# EAGLE design H08R6 (EAGLE 9.6.1)

## Sheet 1 of 2
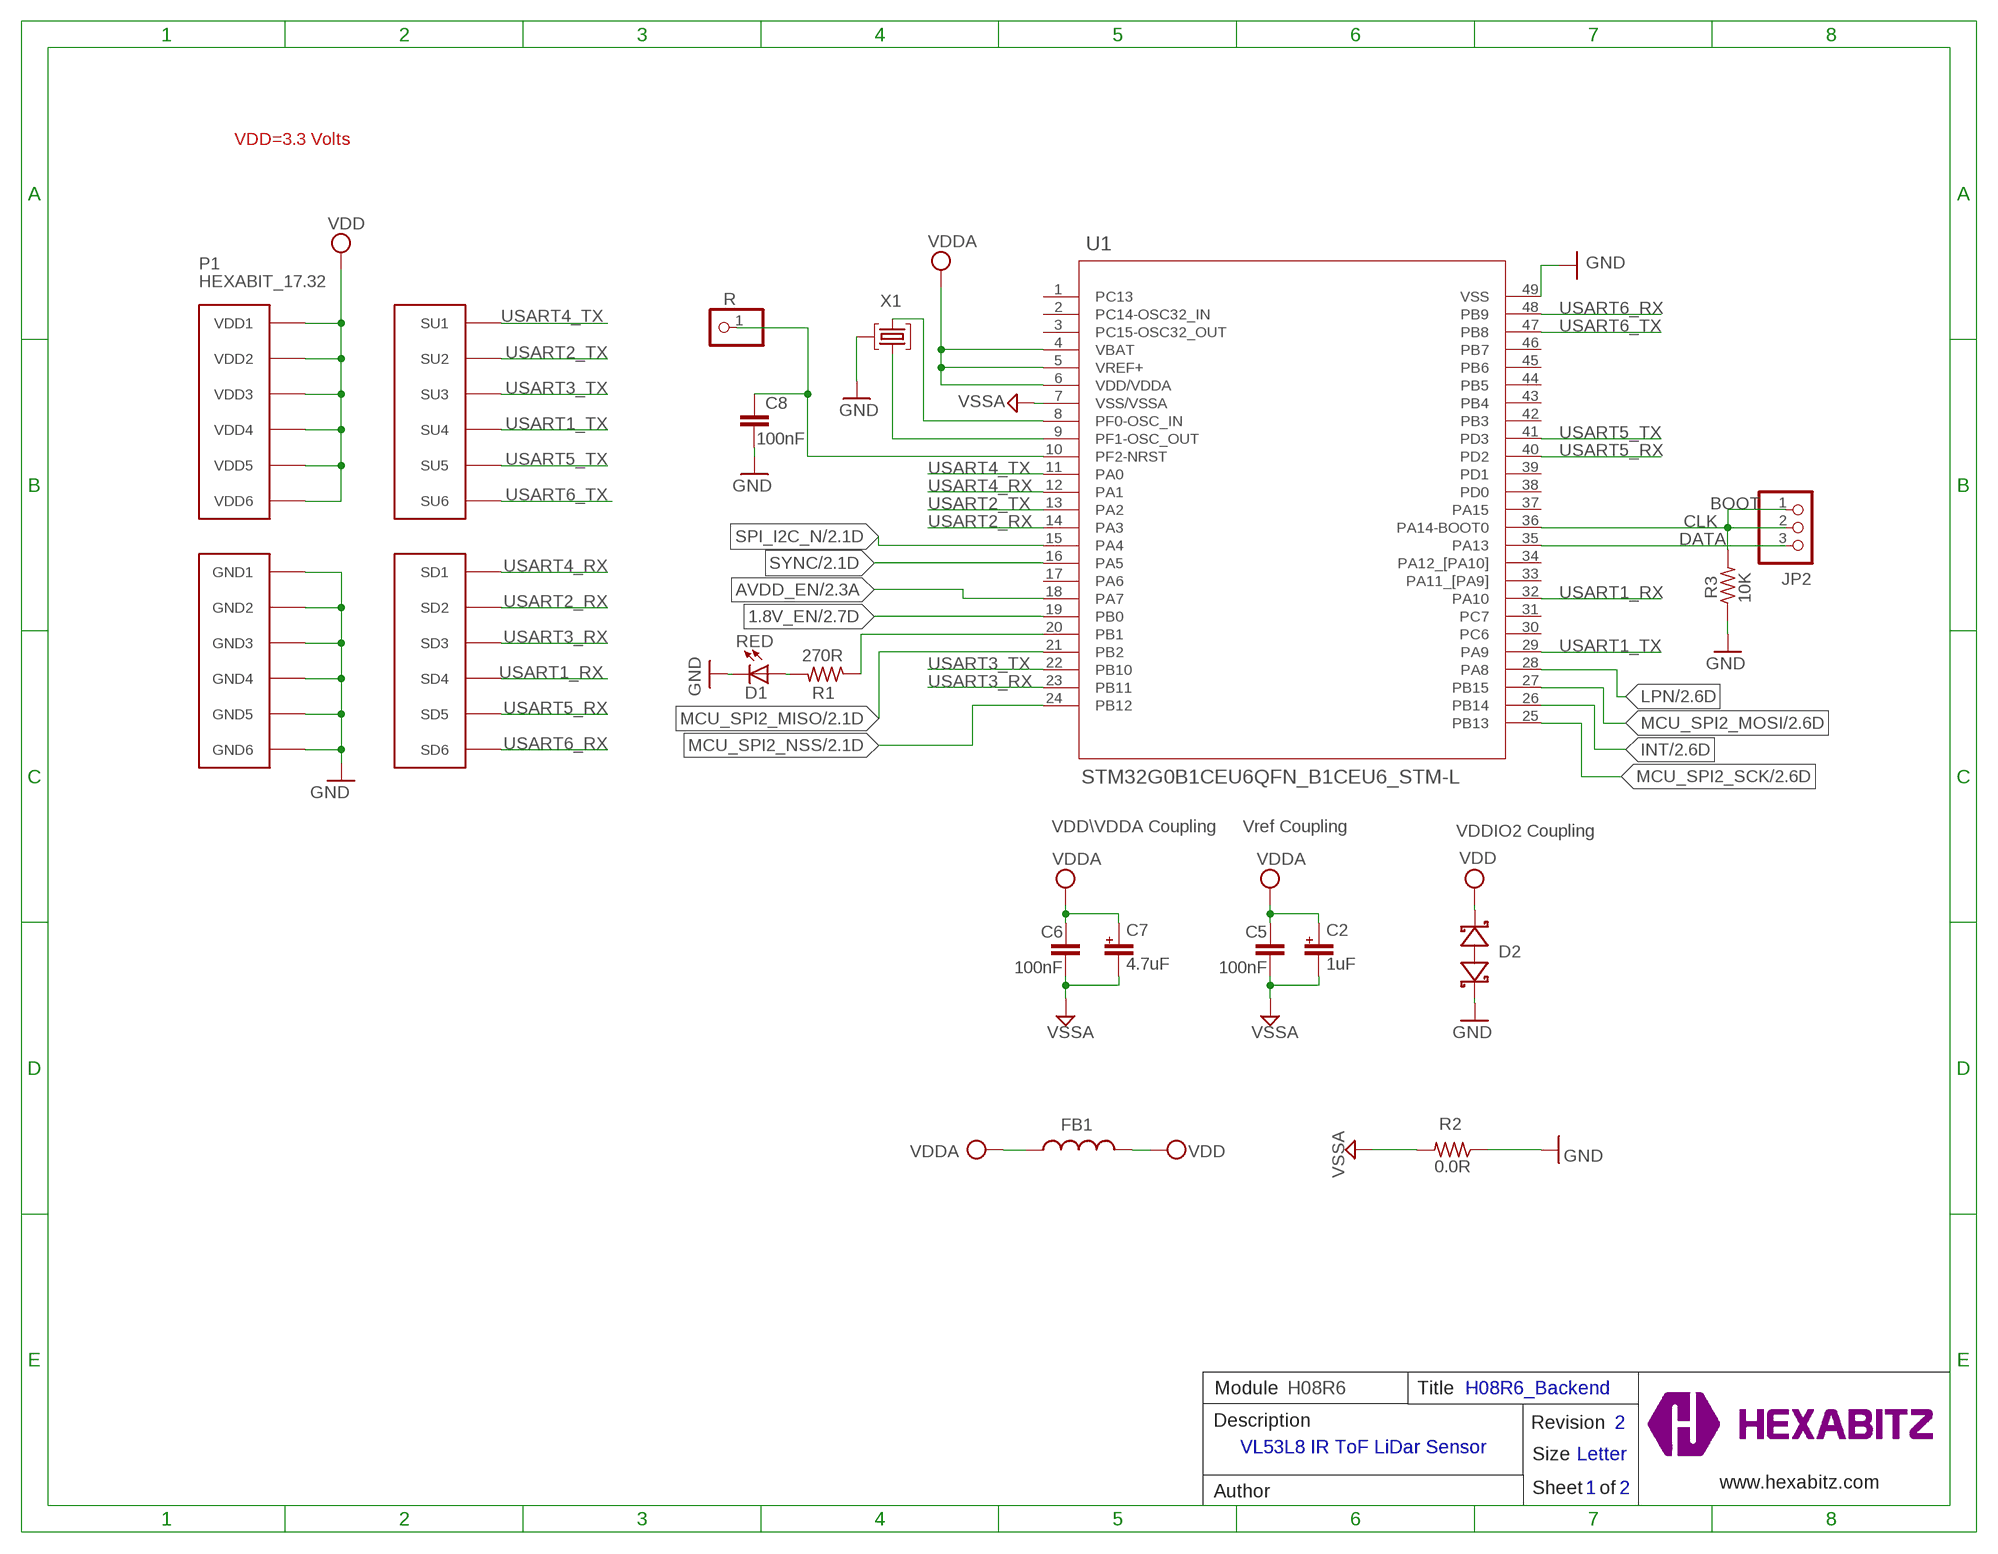
[diagram p0: schematic, sheet 1]

### Parts
C2  1uF  C-0603-POL  [C-0603-POL]
C5  100nF  C-0402  [C-0402]
C6  100nF  C-0402  [C-0402]
C7  4.7uF  C-0603-POL  [C-0603-POL]
C8  100nF  C-0402  [C-0402]
D1  RED  VLMS1300-GS08  [VLMS1300-GS08]
D2  BOURNS_CDSOD323-T03SCBOURNS_CDSOD323-T03SC_0_0  [BOURNS_CDSOD323-T03SC_0]
FB1  FB-TDK_MMZ1608Y300B  [FB-TDK_MMZ1608Y300B]
JP2  PINHD-1X3  [1X03]
P1  HEXABIT_17.32  [HEXABIT_17.32]
R  R  PINHD-1X1  [1X01]
R1  270R  R-0402  [R-0402]
R2  0.0R  R-0402  [R-0402]
R3  10K  R-0402  [R-0402]
TRIMBLE-LOGO1  HEXA-LOGO  [HEXA-LOGO]
U1  STM32G0B1CEU6QFN_B1CEU6_STM-L  [QFN_B1CEU6_STM-L]
X1  XTALL_CSTCE8M00G52  [XTALL_CSTCE8M00G52]

### Nets
1.8V_EN: U1.19(PB0) ; also sheet 2
AVDD_EN: U1.18(PA7) ; also sheet 2
CLK: JP2.1 JP2.2 R3.2 U1.36(PA14-BOOT0)
DATA: JP2.3 U1.35(PA13)
GND: C8.2 D1.C D2.2(C) P1.PAD_PD7(GND1) P1.PAD_PD8(GND2) P1.PAD_PD9(GND3) P1.PAD_PD10(GND4) P1.PAD_PD11(GND5) P1.PAD_PD12(GND6) R2.1 R3.1 U1.49(VSS) X1.P$2 ; also sheet 2
INT: U1.26(PB14) ; also sheet 2
LPN: U1.28(PA8) ; also sheet 2
MCU_SPI2_MISO: U1.21(PB2) ; also sheet 2
MCU_SPI2_MOSI: U1.27(PB15) ; also sheet 2
MCU_SPI2_NSS: U1.24(PB12) ; also sheet 2
MCU_SPI2_SCK: U1.25(PB13) ; also sheet 2
N$3: D1.A R1.2
N$4: C8.1 R.1 U1.10(PF2-NRST)
N$5: U1.9(PF1-OSC_OUT) X1.P$1
N$6: U1.8(PF0-OSC_IN) X1.P$3
N$7: R1.1 U1.20(PB1)
SPI_I2C_N: U1.15(PA4) ; also sheet 2
SYNC: U1.16(PA5) ; also sheet 2
USART1_RX: P1.PAD_PD4(SD4) U1.32(PA10)
USART1_TX: P1.PAD_PU4(SU4) U1.29(PA9)
USART2_RX: P1.PAD_PD2(SD2) U1.14(PA3)
USART2_TX: P1.PAD_PU2(SU2) U1.13(PA2)
USART3_RX: P1.PAD_PD3(SD3) U1.23(PB11)
USART3_TX: P1.PAD_PU3(SU3) U1.22(PB10)
USART4_RX: P1.PAD_PD1(SD1) U1.12(PA1)
USART4_TX: P1.PAD_PU1(SU1) U1.11(PA0)
USART5_RX: P1.PAD_PD5(SD5) U1.40(PD2)
USART5_TX: P1.PAD_PU5(SU5) U1.41(PD3)
USART6_RX: P1.PAD_PD6(SD6) U1.48(PB9)
USART6_TX: P1.PAD_PU6(SU6) U1.47(PB8)
VDD: D2.1(A) FB1.2 P1.PAD_PU7(VDD1) P1.PAD_PU8(VDD2) P1.PAD_PU9(VDD3) P1.PAD_PU10(VDD4) P1.PAD_PU11(VDD5) P1.PAD_PU12(VDD6) ; also sheet 2
VDDA: C2.1 C5.1 C6.1 C7.1 FB1.1 U1.4(VBAT) U1.5(VREF+) U1.6(VDD/VDDA)
VSSA: C2.2 C5.2 C6.2 C7.2 R2.2 U1.7(VSS/VSSA)
Unconnected: U1.1(PC13) U1.2(PC14-OSC32_IN) U1.3(PC15-OSC32_OUT) U1.17(PA6) U1.30(PC6) U1.31(PC7) U1.33(PA11_[PA9]) U1.34(PA12_[PA10]) U1.37(PA15) U1.38(PD0) U1.39(PD1) U1.42(PB3) U1.43(PB4) U1.44(PB5) U1.45(PB6) U1.46(PB7)

### Notes on the sheet
- VDD=3.3 Volts
- BOOT
- VDD\VDDA Coupling | Vref Coupling | VDDIO2 Coupling
- Module | H08R6 | Title | H08R6_Backend
- Description | Revision | 2
- VL53L8 IR ToF LiDar Sensor
- Size | Letter
- www.hexabitz.com
- Author | Sheet   of | 1 | 2
- C:/Users/Admin/Desktop/logodraft.bmp

## Sheet 2 of 2
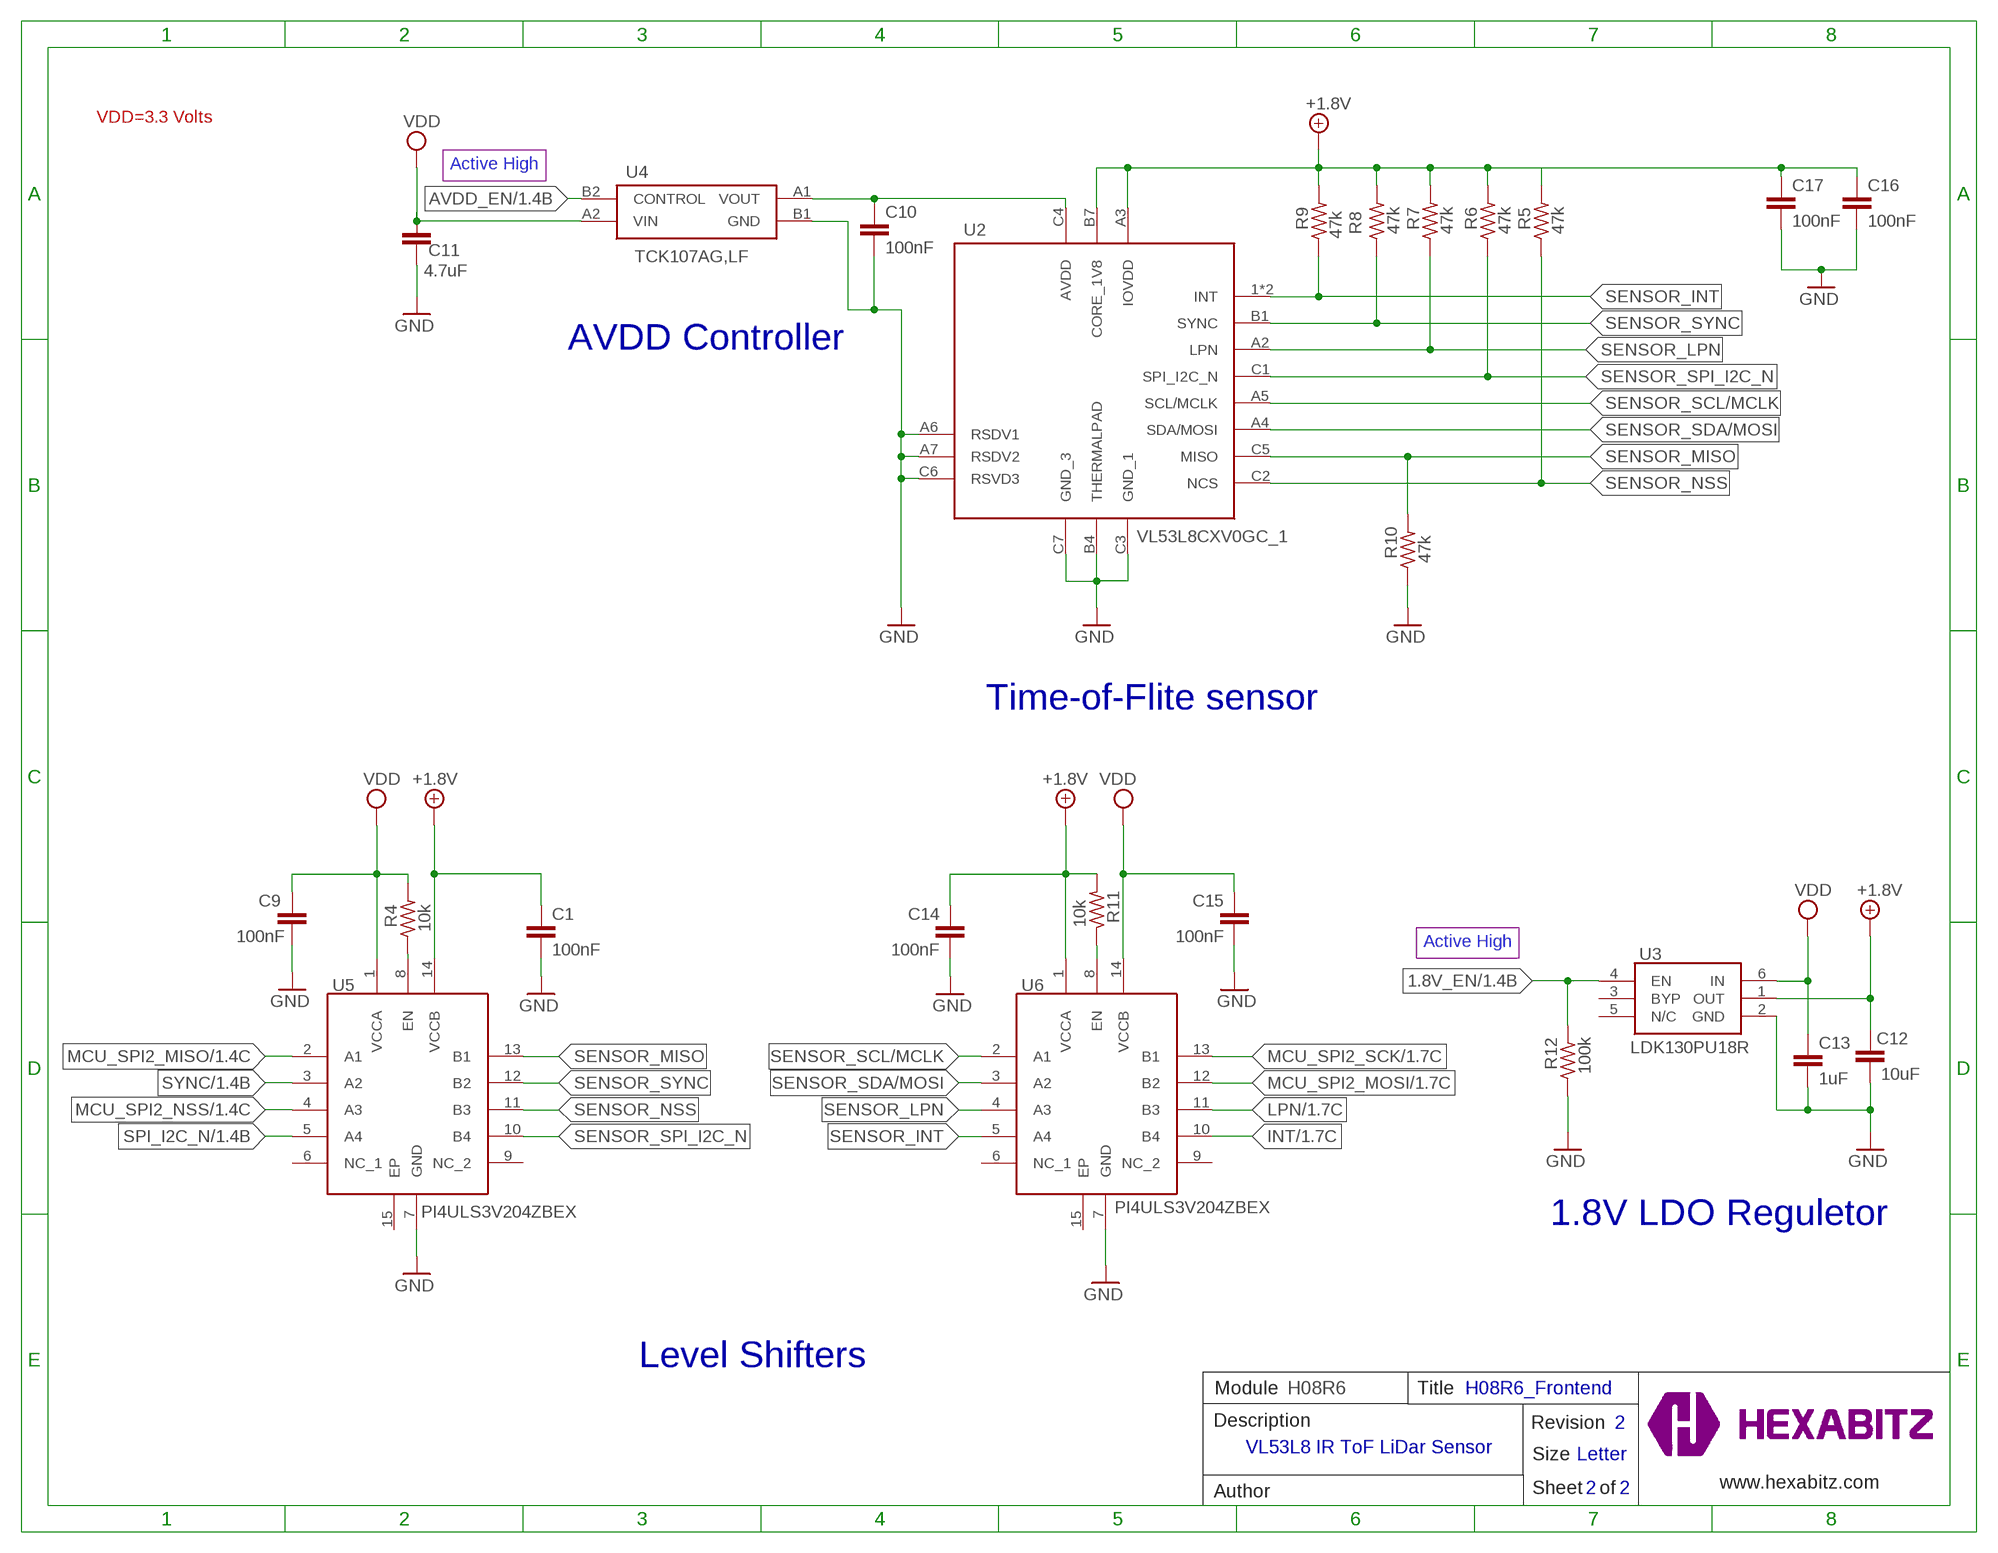
[diagram p1: schematic, sheet 2]

### Parts
C1  100nF  C-0402  [C-0402]
C9  100nF  C-0402  [C-0402]
C10  100nF  C-0402  [C-0402]
C11  4.7uF  C-0603  [C-0603]
C12  10uF  C-0402  [C-0402]
C13  1uF  C-0402  [C-0402]
C14  100nF  C-0402  [C-0402]
C15  100nF  C-0402  [C-0402]
C16  100nF  C-0402  [C-0402]
C17  100nF  C-0402  [C-0402]
R4  10k  R-0402  [R-0402]
R5  47k  R-0402  [R-0402]
R6  47k  R-0402  [R-0402]
R7  47k  R-0402  [R-0402]
R8  47k  R-0402  [R-0402]
R9  47k  R-0402  [R-0402]
R10  47k  R-0402  [R-0402]
R11  10k  R-0402  [R-0402]
R12  100k  R-0402  [R-0402]
U2  VL53L8CXV0GC_1  [VL53L8CXV0GC1]
U3  LDK130PU18R  [LDK130PU18R]
U4  TCK107AG,LF  [BGA4C40P2X2_79X79X59]
U5  PI4ULS3V204ZBEX  [PI4ULS3V204ZBEX]
U6  PI4ULS3V204ZBEX  [PI4ULS3V204ZBEX]

### Nets
1.8V_EN: R12.2 U3.4(EN) ; also sheet 1
+1.8V: C1.1 C12.1 C14.1 C16.1 C17.1 R5.2 R6.2 R7.2 R8.2 R9.2 R11.2 U2.A3(IOVDD) U2.B7(CORE_1V8) U3.1(OUT) U5.14(VCCB) U6.1(VCCA)
AVDD_EN: U4.B2(CONTROL) ; also sheet 1
CONTROLLED_AVDD: C10.1 U2.C4(AVDD) U4.A1(VOUT)
GND: C1.2 C9.2 C10.2 C11.2 C12.2 C13.2 C14.2 C15.2 C16.2 C17.2 R10.1 R12.1 U2.A6(RSDV1) U2.A7(RSDV2) U2.B4(THERMALPAD) U2.C3(GND_1) U2.C6(RSVD3) U2.C7(GND_3) U3.2(GND) U4.B1(GND) U5.7(GND) U6.7(GND) ; also sheet 1
INT: U6.10(B4) ; also sheet 1
LPN: U6.11(B3) ; also sheet 1
MCU_SPI2_MISO: U5.2(A1) ; also sheet 1
MCU_SPI2_MOSI: U6.12(B2) ; also sheet 1
MCU_SPI2_NSS: U5.4(A3) ; also sheet 1
MCU_SPI2_SCK: U6.13(B1) ; also sheet 1
N$1: R4.1 U5.8(EN)
N$2: R11.1 U6.8(EN)
SENSOR_INT: R9.1 U2.1(INT) U2.A1(INT) U6.5(A4)
SENSOR_LPN: R7.1 U2.A2(LPN) U6.4(A3)
SENSOR_MISO: R10.2 U2.C5(MISO) U5.13(B1)
SENSOR_NSS: R5.1 U2.C2(NCS) U5.11(B3)
SENSOR_SCL/MCLK: U2.A5(SCL/MCLK) U6.2(A1)
SENSOR_SDA/MOSI: U2.A4(SDA/MOSI) U6.3(A2)
SENSOR_SPI_I2C_N: R6.1 U2.C1(SPI_I2C_N) U5.10(B4)
SENSOR_SYNC: R8.1 U2.B1(SYNC) U5.12(B2)
SPI_I2C_N: U5.5(A4) ; also sheet 1
SYNC: U5.3(A2) ; also sheet 1
VDD: C9.1 C11.1 C13.1 C15.1 R4.2 U3.6(IN) U4.A2(VIN) U5.1(VCCA) U6.14(VCCB) ; also sheet 1
Unconnected: U3.3(BYP) U3.5(N/C) U5.6(NC_1) U5.9(NC_2) U5.15(EP) U6.6(NC_1) U6.9(NC_2) U6.15(EP)

### Notes on the sheet
- VDD=3.3 Volts
- Active High
- AVDD Controller
- Time-of-Flite sensor
- Active High
- 1.8V LDO Reguletor
- Level Shifters
- Module | H08R6 | Title | H08R6_Frontend
- Description | Revision | 2
- VL53L8 IR ToF LiDar Sensor
- Size | Letter
- www.hexabitz.com
- Author | Sheet   of | 2 | 2

## Library data of the parts
C1 C5 C6 C8-C10 C12-C17 = HEXABITZ_RCLS:C-0402: CAP CER 10% 0402
C2 C7 = HEXABITZ_RCLS:C-0603-POL
C11 = HEXABITZ_RCLS:C-0603: CAP CER 10% X7R 0603
D1 = HEXABITZ_USER_INTERFACE_PARTS:VLMS1300-GS08: Red 0603 130° Clear 54 mcd 2 V Surface Mount ChipLED ; Octopart Url : http://octopart.com/vlms1300-gs08-vishay-21709201; MFN: Vishay; MPN: VLMS1300-GS08; OCTOPART_URL: https://octopart.com/vlms1300-gs08-vishay-21709201?r=sp&s=_gcP4_q8T1SC6PJQPTQ9yA
D2 = HEXABITZ_RCLS:BOURNS_CDSOD323-T03SC: CDSOD323-TxxSC - TVS Diode Series; DESCRIPTION: Dio Tvs Vwm 03V 500W Bidir Sod323 / Tape & Reel - 7" Reel; MFN: Bourns; MPN: CDSOD323-T03SC; OCTOPART_URL: https://octopart.com/cdsod323-t03sc-bourns-10487153?r=sp
FB1 = HEXABITZ_RCLS:FB-TDK_MMZ1608Y300B: Ferrite Beads Multi-Layer 30Ohm 25% 100MHz 1.5A 50mOhm DCR 0603; MFN: TDK; MPN: MMZ1608Y300B; OCTOPART_URL: https://octopart.com/mmz1608y300b-tdk-368280?r=sp&s=cd9_2ZEqQ9q9UNBuQgHAiA
JP2 = pinhead:PINHD-1X3: PIN HEADER
P1 = hexabitz_connectors:HEXABIT_?: Hexabitz Hexagon Module Connector Hexagon side length = 28.87mm.
R = HEXABITZ_USER_INTERFACE_PARTS:PINHD-1X1: PIN HEADER; MFN: TE Connectivity; MPN: 87227-1; OCTOPART_URL: https://octopart.com/87227-1-te+connectivity-39512052?r=sp
R1 R3-R12 = HEXABITZ_RCLS:R-0402: Thick Film Resistors - SMD 0603
R2 = HEXABITZ_RCLS:R-0402: Thick Film Resistors - SMD 0603; MFN: Yageo; MPN: RC0603JR-070RL; OCTOPART_URL: https://octopart.com/rc0603jr-070rl-yageo-1241539?r=sp&s=X2NteqRjRNWrnx42Y0aliA; RESISTANCE: 0.0 Ohm
TRIMBLE-LOGO1 = HEXABITZ_USER_INTERFACE_PARTS:HEXA-LOGO: Trimble-Logo
U1 = HEXABITZ_ICs:STM32G0B1CEU6; COPYRIGHT: Copyright (C) 2021 Ultra Librarian. All rights reserved.; MANUFACTURER_PART_NUMBER: STM32G0B1CEU6; MFR_NAME: STMicroelectronics
U2 = HEXABITZ_ICs:VL53L8CXV0GC_1: Low-power high-performance 8x8 multizone Time-of-Flight sensor 940 nm, 6.4x3.0x1.75 mm, -30 to 85C Source: Datasheet <https://www.st.com/resource/en/datasheet/vl53l8cx.pdf>; ARROW_PART_NUMBER: VL53L8CXV0GC/1; ARROW_PRICE-STOCK: https://www.arrow.com/en/products/vl53l8cxv0gc1/stmicroelectronics?region=europe; DESCRIPTION: Low-power high-performance 8x8 multizone Time-of-Flight sensor 940 nm, 6.4x3.0x1.75 mm, -30 to 85C; HEIGHT: 1.8mm; MANUFACTURER_NAME: STMicroelectronics; MANUFACTURER_PART_NUMBER: VL53L8CXV0GC/1; MOUSER_PART_NUMBER: 511-VL53L8CXV0GC/1; MOUSER_PRICE-STOCK: https://www.mouser.co.uk/ProductDetail/STMicroelectronics/VL53L8CXV0GC-1?qs=T%252BzbugeAwjhc9idkQC%252BF8g%3D%3D
U3 = HEXABITZ_ICs:LDK130PU18R: LDO Voltage Regulators 300mA current very low noise LDO Source: Datasheet <http://www.st.com/web/en/resource/technical/document/datasheet/DM00076097.pdf>; DESCRIPTION: LDO Voltage Regulators 300mA current very low noise LDO; HEIGHT: 0.5mm; MANUFACTURER_NAME: STMicroelectronics; MANUFACTURER_PART_NUMBER: LDK130PU18R; MOUSER_PART_NUMBER: 511-LDK130PU18R; MOUSER_PRICE-STOCK: https://www.mouser.co.uk/ProductDetail/STMicroelectronics/LDK130PU18R?qs=Us3gTOFd0HosQ%2FeNbz5XPw%3D%3D
U4 = HEXABITZ_ICs:TCK107AG,LF: Power Switch ICs - Power Distribution Load Switch IC Source: Datasheet <https://toshiba.semicon-storage.com/info/docget.jsp?did=30131&prodName=TCK106AG>; DESCRIPTION: Power Switch ICs - Power Distribution Load Switch IC; HEIGHT: 0.59mm; MANUFACTURER_NAME: Toshiba; MANUFACTURER_PART_NUMBER: TCK107AG,LF; MOUSER_PART_NUMBER: 757-TCK107AGLF; MOUSER_PRICE-STOCK: https://www.mouser.co.uk/ProductDetail/Toshiba/TCK107AGLF?qs=lX6dEUlT%252Bgfv0djoZbXdYw%3D%3D
U5 U6 = HEXABITZ_ICs:PI4ULS3V204ZBEX: Voltage Level Translator Bidirectional 4 Circuit 1 Channel 2Mbps, 24Mbps 14-TQFN (3.5x3.5) Source: Datasheet <https://www.diodes.com/assets/Datasheets/PI4ULS3V204.pdf>; DESCRIPTION: Voltage Level Translator Bidirectional 4 Circuit 1 Channel 2Mbps, 24Mbps 14-TQFN (3.5x3.5); HEIGHT: 0.9mm; MANUFACTURER_NAME: Diodes Incorporated; MANUFACTURER_PART_NUMBER: PI4ULS3V204ZBEX; MOUSER_PART_NUMBER: 729-PI4ULS3V204ZBEX; MOUSER_PRICE-STOCK: https://www.mouser.co.uk/ProductDetail/Diodes-Incorporated/PI4ULS3V204ZBEX?qs=AQlKX63v8RsT3Gro83mlXA%3D%3D
X1 = HEXABITZ_RCLS:XTALL_CSTCE8M00G52: MURATA CSTCE8M00G52-R0 RESONATOR, SMD, 8MHZ ; Octopart Url : https://octopart.com/cstce8m00g52-r0-murata-7145559; MFN: Murata; MPN: CSTCE8M00G52Z-R0; OCTOPART_URL: https://octopart.com/cstce8m00g52z-r0-murata-17755941?r=sp&s=JDnNJnrHQhyS8Zk4ofFWXw

## Board
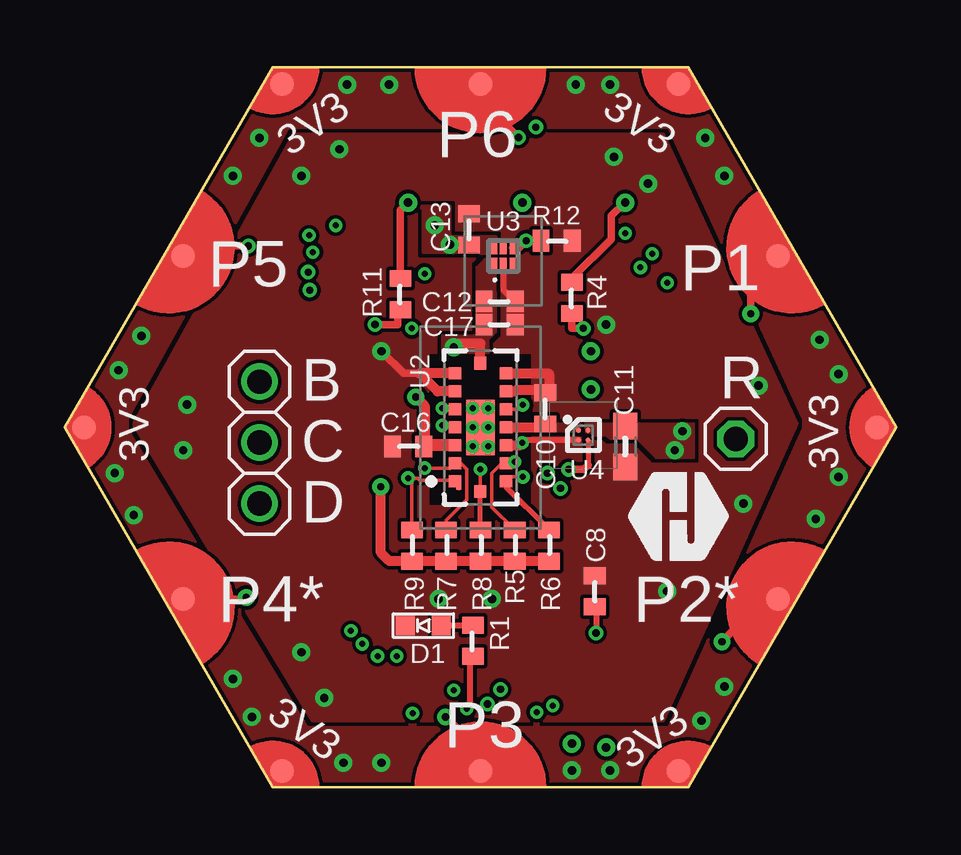
[diagram p2: board, top side]
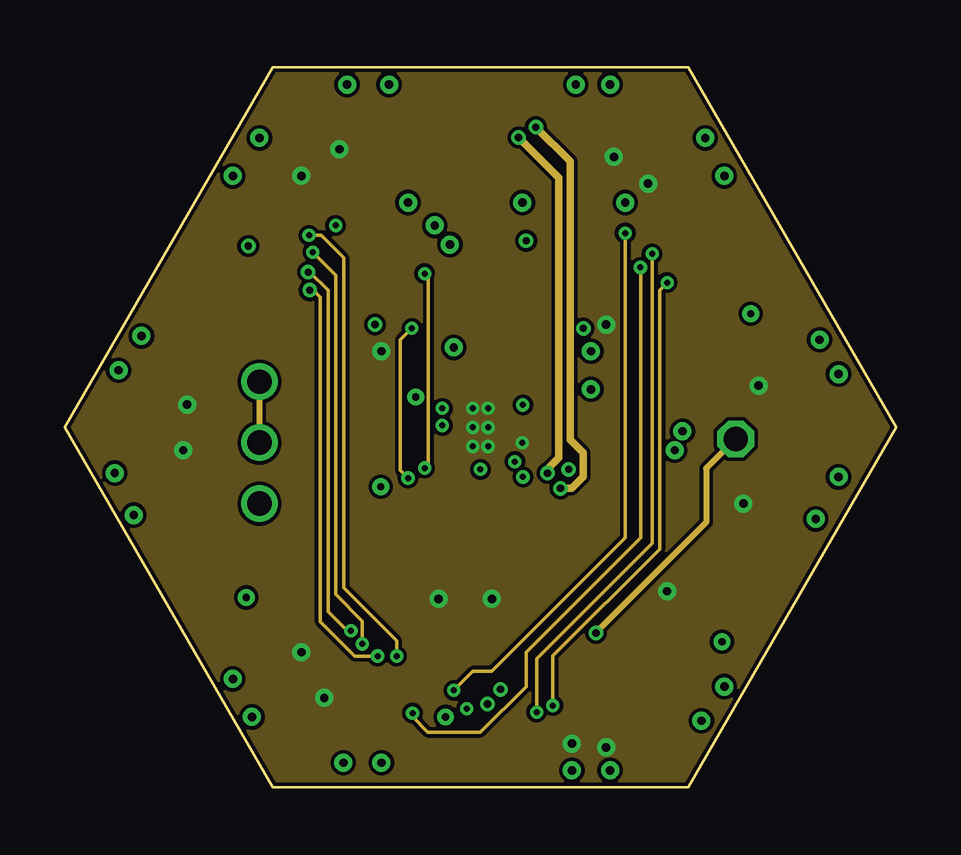
[diagram p3: board, inner layer Route2]
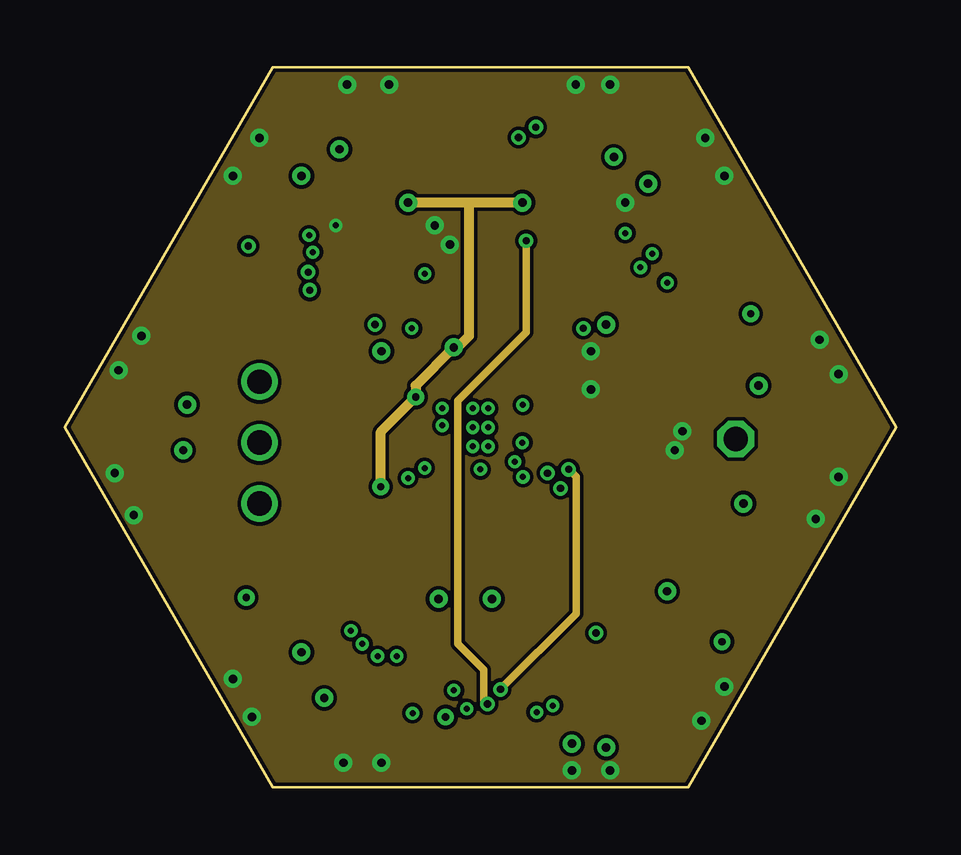
[diagram p4: board, inner layer Route15]
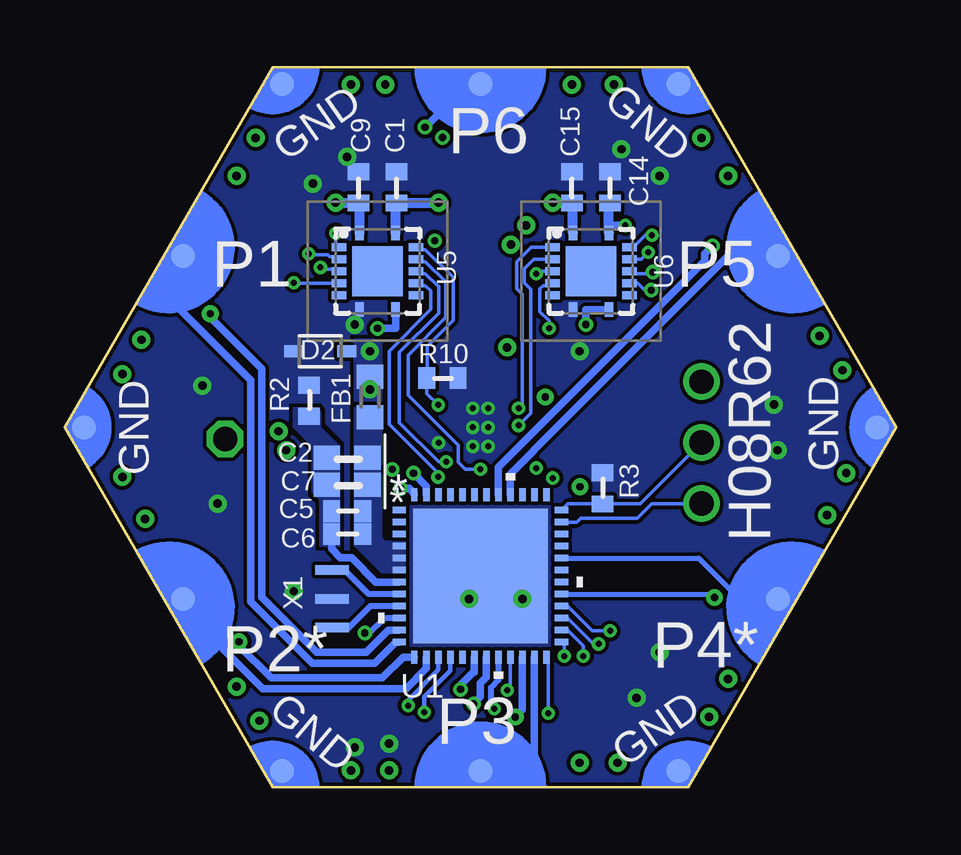
[diagram p5: board, bottom side, seen from below]

Size 34.64 x 30 mm. Coordinates in mm from the lower left corner, seen from the top.
Copper layers (1*2+15*16): Top 0.035mm / dielectric 0.175mm / Route2 0.035mm / dielectric 1.11mm / Route15 0.035mm / dielectric 0.175mm / Bottom 0.035mm
Design rules "4_layer *": minimum track width 6mil, minimum drill 0.2mm, track to track 6mil, track to pad 6mil, pad to pad 6mil, via to via 6mil, smd to smd 0mil, copper to edge 0.15mm, drill to drill 6mil, minimum pad ring 6mil, minimum via ring 3mil, stop-mask expansion 2mil, vias tented up to drill 15mil, thermal gap 10mil

### Footprints (pad centres in the part's own frame; a part is rotated, then mirrored left to right if it is on the bottom)
C-0402 = smd 0.7 x 0.9: 1 -0.65,0; 2 0.65,0
C-0603-POL = smd 1.1 x 1: 1 -0.85,0; 2 0.85,0
C-0603 = smd 1.1 x 1: 1 -0.85,0; 2 0.85,0
VLMS1300-GS08 = smd 0.8 x 0.8: A 0,0.75; C 0,-0.75
BOURNS_CDSOD323-T03SC_0 = smd 0.8 x 0.5: 1 -1.1,0; 2 1.1,0
FB-TDK_MMZ1608Y300B = smd 1 x 1.1: 1 -0.85,0; 2 0.85,0
1X03 = drill 1.016: 1 -2.54,0; 2 0,0; 3 2.54,0
HEXABIT_17.32 = smd 1 x 1 bottom: PAD_PD1 12.39,7.15; PAD_PD2 12.39,-7.15; PAD_PD3 0,-14.31; PAD_PD4 -12.39,-7.15; PAD_PD5 -12.39,7.15; PAD_PD6 0,14.31; PAD_PD7 8.26,14.31; PAD_PD8 16.52,0; PAD_PD9 8.26,-14.31; PAD_PD10 -8.26,-14.31; PAD_PD11 -16.52,0; PAD_PD12 -8.26,14.31 | smd 1 x 1: PAD_PU1 12.39,7.15; PAD_PU2 12.39,-7.15; PAD_PU3 0,-14.31; PAD_PU4 -12.39,-7.15; PAD_PU5 -12.39,7.15; PAD_PU6 0,14.31; PAD_PU7 8.26,14.31; PAD_PU8 16.52,0; PAD_PU9 8.26,-14.31; PAD_PU10 -8.26,-14.31; PAD_PU11 -16.52,0; PAD_PU12 -8.26,14.31
1X01 = drill 1.016 octagon: 1 0,0
R-0402 = smd 0.7 x 0.9: 1 -0.65,0; 2 0.65,0
QFN_B1CEU6_STM-L = smd 0.55 x 0.254: 1 -3.38,2.751; 2 -3.38,2.251; 3 -3.38,1.75; 4 -3.38,1.25; 5 -3.38,0.75; 6 -3.38,0.25; 7 -3.38,-0.25; 8 -3.38,-0.75; 9 -3.38,-1.25; 10 -3.38,-1.75; 11 -3.38,-2.251; 12 -3.38,-2.751; 25 3.38,-2.751; 26 3.38,-2.251; 27 3.38,-1.75; 28 3.38,-1.25; 29 3.38,-0.75; 30 3.38,-0.25; 31 3.38,0.25; 32 3.38,0.75; 33 3.38,1.25; 34 3.38,1.75; 35 3.38,2.251; 36 3.38,2.751 | smd 0.254 x 0.55: 13 -2.751,-3.38; 14 -2.251,-3.38; 15 -1.75,-3.38; 16 -1.25,-3.38; 17 -0.75,-3.38; 18 -0.25,-3.38; 19 0.25,-3.38; 20 0.75,-3.38; 21 1.25,-3.38; 22 1.75,-3.38; 23 2.251,-3.38; 24 2.751,-3.38; 37 2.751,3.38; 38 2.251,3.38; 39 1.75,3.38; 40 1.25,3.38; 41 0.75,3.38; 42 0.25,3.38; 43 -0.25,3.38; 44 -0.75,3.38; 45 -1.25,3.38; 46 -1.75,3.38; 47 -2.251,3.38; 48 -2.751,3.38 | smd 5.6 x 5.6: 49 0,0
VL53L8CXV0GC1 = smd 0.2 x 0.1: 1 -0.9,-2.55 | smd 0.515 x 0.5: A1 -1.058,-2.25; A2 -1.058,-1.5; A3 -1.058,-0.75; A4 -1.058,0; A5 -1.058,0.75; A6 -1.058,1.5; A7 -1.058,2.25; C1 1.058,-2.25; C2 1.058,-1.5; C3 1.058,-0.75; C4 1.058,0; C5 1.058,0.75; C6 1.058,1.5; C7 1.058,2.25 | smd 0.5 x 0.535: B1 0,-2.668; B7 0,2.668 | smd 1.2 x 2.316: B4 0,0
LDK130PU18R = smd 0.28 x 0.53: 1 -0.4,-0.34; 2 0,-0.34; 3 0.4,-0.34; 4 0.4,0.34; 5 0,0.34; 6 -0.4,0.34
BGA4C40P2X2_79X79X59 = smd 0.208 x 0.208: A1 -0.2,0.2; A2 0.2,0.2; B1 -0.2,-0.2; B2 0.2,-0.2
PI4ULS3V204ZBEX = smd 0.6 x 0.35: 1 -1.6,-0.75; 7 1.6,-0.75; 8 1.6,0.75; 14 -1.6,0.75 | smd 0.35 x 0.6: 2 -1,-1.6; 3 -0.5,-1.6; 4 0,-1.6; 5 0.5,-1.6; 6 1,-1.6; 9 1,1.6; 10 0.5,1.6; 11 0,1.6; 12 -0.5,1.6; 13 -1,1.6 | smd 2.1 x 2.1: 15 0,0
XTALL_CSTCE8M00G52 = smd 1.4 x 0.4: P$1 0,1.2; P$2 0,0; P$3 0,-1.2

### Placement (x,y rotation side)
C1  20.81,25 90 bottom
C2  22.88,13.73 180 bottom
C5  22.88,11.51 180 bottom
C6  22.88,10.55 180 bottom
C7  22.88,12.62 180 bottom
C8  22.08,8.17 90 top
C9  22.4,25 90 bottom
C10  20.02,15.79 90 top
C11  23.35,14.21 270 top
C12  18.11,20.24 0 top
C13  16.84,23.25 90 top
C14  13.51,25 90 bottom
C15  11.92,25 90 bottom
C16  14.3,14.21 180 top
C17  18.11,19.29 0 top
D1  14.94,6.74 270 top
D2  23.99,18.18 180 bottom
FB1  21.92,16.27 90 bottom
JP2  8.11,14.36 270 top
P1  17.32,15 0 top
R  27.96,14.52 0 top
R1  17,6.11 90 top
R2  24.46,16.11 270 bottom
R3  12.24,12.46 270 bottom
R4  21.13,20.4 90 top
R5  18.75,10.08 270 top
R6  20.18,10.08 270 top
R7  15.89,10.08 270 top
R8  17.32,10.08 270 top
R9  14.46,10.08 270 top
R10  18.91,17.06 180 bottom
R11  13.99,20.56 90 top
R12  20.5,22.78 180 top
TRIMBLE-LOGO1  25.58,9.44 0 top
U1  17.32,8.81 0 bottom
U2  17.32,15 0 top
U3  18.27,22.14 0 top
U4  21.61,14.68 0 top
U5  21.61,21.51 270 bottom
U6  12.72,21.51 270 bottom
X1  23.51,7.86 180 bottom

### Tracks (layer width: path | path; a pad name or v marks a point on that pad's centre or on a via)
1.8V_EN  (via drill 0.3 pad 0.6)
  Top 0.305: U3.4 18.93,22.48 v19.23,22.78 R12.2
  Route15 0.305: v17.61,3.48 17.45,3.64 17.45,4.91 16.37,5.99 16.37,16.11 19.23,18.97 v19.23,22.78
  Bottom 0.305: U1.19 17.07,4.59 17.32,4.34 17.32,3.77 v17.61,3.48
+1.8V  (via drill 0.3 pad 0.7, 0.35 pad 0.75)
  Top 0.305: R11.2 13.99,24.05 v14.3,24.37
  Top 0.406: v14.62,16.27 15,15.89 15,14.25 | R6.2 R5.2 R8.2 R7.2 R9.2 13.53,9.43 13.17,9.78 v13.17,12.53 | U2.B7 17.32,18.49 16.37,18.49 v16.21,18.33
  Top 0.508: U2.A3 15,14.25 C16.1
  Route15 0.406: v13.17,12.53 13.17,14.82 v14.62,16.27 14.62,16.75 v16.21,18.33 16.37,18.33 16.84,18.81 16.84,24.37 | v19.07,24.37 16.84,24.37 | 16.84,24.37 v14.3,24.37
  Bottom 0.406: U6.1 13.47,24.31 C14.1 14.29,24.35 v14.3,24.37 | U5.14 20.86,24.31 C1.1 19.08,24.35 v19.07,24.37
  pour Top (no thermals): 17.64,17.38 17.64,18.65 17.96,18.97 17.96,21.98 17.48,21.98 17.16,21.67 17.16,18.81 15.73,18.81 15.73,17.86 17.16,17.86 17.16,17.38
AVDD_EN  (via drill 0.3 pad 0.6)
  Top 0.203: U4.B2 21.81,13.43
  Top 0.305: 21.81,13.43 21.63,13.25 v21,13.25
  Route15 0.305: v18.16,4.09 21.31,7.25 21.31,12.93 v21,13.25
  Bottom 0.305: v18.16,4.09 18.16,4.26 17.6,4.82 17.57,4.79 U1.18
CLK
  Route2 0.254: JP2.1 JP2.2
  Bottom 0.152: U1.36 13.69,11.81 R3.2 10.67,11.81 JP2.2
CONTROLLED_AVDD
  Top 0.406: U2.C4 19.88,15 C10.1
  pour Top (no thermals): 21.45,15.16 18.27,15.16 18.27,14.84 21.45,14.84
DATA
  Bottom 0.152: U1.35 13.3,11.06 13.15,11.22 10.78,11.22 10.18,11.82 JP2.3
GND  (via drill 0.25 pad 0.55, 0.35 pad 0.75)
  Top 0.254: U3.2 18.27,20.73 C12.2 | U2.B4 17,15.32 v17,15.79 | v19.07,14.36 19.18,14.48 U4.B1
  Top 0.305: 14.78,17.25 14.12,17.25 v13.19,18.17
  Top 0.406: U2.A6 15.53,16.5 14.78,17.25 U2.A7 | U2.C7 20.15,17.25 20.18,17.22 20.18,16.6 20.14,16.57 | 20.14,16.57 C10.2 | U2.C6 18.76,16.5 18.82,16.57 20.14,16.57 | U2.C3 18.95,14.25 v19.07,14.36
  other vias: 17,15 17.64,14.21 17.64,15.79 17.64,15 17,14.21 22.88,26.27 24.3,25.16 9.86,25.48 11.45,26.59 5.1,15.95 4.94,14.05 9.86,5.63 10.81,3.73 28.91,16.75 28.27,11.82 25.1,8.17 21.13,1.82 22.56,1.66 15.57,7.86 17.8,7.86 22.56,19.29
  pour Top (rank 2, no thermals): 9.54,27.22 24.94,27.22 30.5,15.16 24.94,2.78 10.34,2.78 2.87,15.16
  pour Route2 (rank 2, no thermals): 8.59,29.92 25.89,29.92 34.62,14.84 26.05,-0.08 8.75,-0.08 0.02,15 0.02,15 0.02,15 5.53,24.19
  pour Bottom (rank 2, no thermals): 8.59,29.92 25.89,29.92 34.62,14.84 26.05,-0.08 8.75,-0.08 0.02,15 0.02,15 0.02,15 5.53,24.19
  cutout Top (no thermals): 15.26,18.02 19.38,18.02 19.38,11.82 15.26,11.82
INT  (via drill 0.25 pad 0.55, 0.3 pad 0.6)
  Route2 0.152: v13.03,5.47 12.08,5.47 10.66,6.9 10.66,20.43 10.36,20.72 v10.21,20.72
  Bottom 0.152: 10.39,20.63 10.48,20.72 | 10.48,20.72 10.77,21.01 U6.10 | v10.21,20.72 10.48,20.72 | U1.26 13.9,6.59 13.73,6.59 13.03,5.9 v13.03,5.47
LPN  (via drill 0.25 pad 0.55, 0.3 pad 0.6)
  Route2 0.152: v11.92,6.52 11.76,6.52 10.97,7.32 10.97,20.71 10.21,21.47 v10.14,21.47
  Bottom 0.152: U6.11 11.02,21.41 10.2,21.41 v10.14,21.47 | U1.28 13.9,7.59 13.73,7.59 12.66,6.52 v11.92,6.52
MCU_SPI2_MISO  (via drill 0.25 pad 0.55)
  Route2 0.152: v16.21,4.05 17,4.84 17.8,4.84 23.35,10.4 v23.35,23.1
  Bottom 0.152: U1.21 16.07,4.19 v16.21,4.05 | v23.35,23.1 23.35,22.65 U5.2
MCU_SPI2_MOSI  (via drill 0.25 pad 0.55)
  Route2 0.152: v12.4,5.98 12.4,6.93 11.29,8.04 11.29,21.35 v10.34,22.3
  Bottom 0.152: U1.27 13.69,7.06 | 13.69,7.06 | v12.4,5.98 12.61,5.98 13.69,7.06 | U6.12 10.63,22.01 v10.34,22.3
MCU_SPI2_NSS  (via drill 0.25 pad 0.55)
  Route2 0.152: v23.99,21.67 24,21.65 24,10.41 19.23,5.63 19.23,4.2 17.32,2.3 15.12,2.3 14.49,2.93 v14.49,3.09
  Bottom 0.152: v23.99,21.67 23.91,21.59 | 23.91,21.59 23.85,21.53 | U1.24 14.49,5.35 v14.49,3.09 | U5.4 23.29,21.59 23.91,21.59
MCU_SPI2_SCK  (via drill 0.25 pad 0.55)
  Route2 0.152: v10.18,23 10.68,23 11.62,22.07 11.62,8.32 13.83,6.11 v13.83,5.47
  Bottom 0.152: U6.13 10.96,22.51 10.46,23 v10.18,23 | v13.83,5.47 13.83,5.95 U1.25
N$1  (via drill 0.3 pad 0.6)
  Top 0.305: v21.61,19.13 21.13,19.13 R4.1
  Bottom 0.305: U5.8 20.86,19.13 v21.61,19.13
N$2  (via drill 0.3 pad 0.6)
  Top 0.305: R11.1 13.99,19.71 13.88,19.71 13.88,19.29 v12.93,19.29
  Bottom 0.305: U6.8 12.93,19.91 v12.93,19.29
N$3
  Top 0.254: D1.A 15.7,6.76 R1.2
N$4  (via drill 0.3 pad 0.6)
  Top 0.254: C8.1 22.14,7.47 v22.14,6.43
  Route2 0.254: R.1 26.72,13.29 26.72,11.05 22.14,6.46 v22.14,6.43
  Bottom 0.254: U1.10 21.34,7.06 21.96,6.43 v22.14,6.43
N$5
  Bottom 0.254: U1.9 21.9,7.56 22.88,6.59 23.44,6.59 X1.P$1
N$6
  Bottom 0.254: U1.8 21.97,8.06 22.96,9.06 X1.P$3
N$7  (via drill 0.25 pad 0.55)
  Top 0.152: 16.91,5.36 R1.1
  Top 0.254: v16.75,3.27 16.9,3.27 16.9,5.36 16.91,5.36
  Bottom 0.254: U1.20 16.57,4.48 16.89,4.16 16.89,3.41 v16.75,3.27
SENSOR_INT  (via drill 0.25 pad 0.55)
  Top 0.152: 14.45,12.75 v14.3,12.89 | R9.1 14.46,12.73 v14.3,12.89 | U2.1 16.26,12.61 U2.A1 16.21,12.8 14.79,12.8 14.7,12.89 v14.3,12.89
  Route2 0.152: v14.46,19.13 13.99,18.65 13.99,13.21 v14.3,12.89
  Bottom 0.152: 14.41,21.1 14.4,21.09 | 14.4,21.09 U6.5 | v14.46,19.13 14.46,19.44 14.85,19.83 14.85,20.78 14.71,20.91 14.58,20.91 14.4,21.09
SENSOR_LPN  (via drill 0.25 pad 0.55)
  Top 0.152: v14.99,13.31 16.07,13.31 U2.A2 16.5,13.5 16.75,13.25 16.75,11.99 15.89,11.13 R7.1
  Route2 0.152: v14.99,13.31 15.15,13.47 15.15,21.25 v15,21.41
  Bottom 0.152: 14.41,21.6 U6.4 14.9,21.51 v15,21.41
SENSOR_MISO  (via drill 0.25 pad 0.55)
  Top 0.152: U2.C5 18.9,15.75 v19.08,15.93
  Bottom 0.152: v19.08,15.93 19.56,16.41 R10.2 19.54,17.08 19.54,18.38 18.46,19.46 18.46,21.26 19.61,22.41 19.91,22.41 U5.13
SENSOR_NSS  (via drill 0.25 pad 0.55)
  Top 0.152: v18.75,13.57 18.68,13.5 U2.C2 18.2,13.5 17.8,13.1 17.8,13.09 17.8,11.68 R5.1
  Bottom 0.152: v18.75,13.57 19.07,13.57 20.7,15.2 20.7,18.13 19.07,19.76 19.07,20.87 19.61,21.41 19.91,21.41 U5.11
SENSOR_SCL/MCLK  (via drill 0.25 pad 0.55)
  Top 0.152: v15.73,15.79 16.22,15.79 U2.A5
  Bottom 0.152: 14.41,22.6 U6.2 15.2,22.51 15.8,21.9 15.8,20.79 15.57,20.56 15.57,15.95 v15.73,15.79
SENSOR_SDA/MOSI  (via drill 0.25 pad 0.55)
  Top 0.152: v15.73,15.08 16.26,15.08 U2.A4
  Bottom 0.152: 14.38,22.07 U6.3 15.11,22.01 15.5,21.62 15.5,21.04 15.23,20.76 15.23,15.58 15.52,15.29 15.53,15.29 v15.73,15.08
SENSOR_SPI_I2C_N  (via drill 0.25 pad 0.55)
  Top 0.152: U2.C1 18.56,12.94 v19.09,12.94
  Top 0.203: U2.C1 18.38,12.53 R6.1
  Bottom 0.152: v19.09,12.94 19.09,13.09 21.13,15.13 21.13,18.17 19.38,19.92 19.38,20.68 19.61,20.91 19.91,20.91 U5.10
SENSOR_SYNC  (via drill 0.25 pad 0.55)
  Top 0.152: v17.32,13.25 U2.B1
  Top 0.203: R8.1 U2.B1
  Bottom 0.152: v17.32,13.25 17.96,13.25 18.25,13.54 18.25,14.26 20.34,16.35 20.34,18.02 18.76,19.59 18.76,21.06 19.61,21.91 19.91,21.91 U5.12
SPI_I2C_N  (via drill 0.25 pad 0.55)
  Route2 0.152: v20.33,3.41 20.33,5.48 24.78,9.92 24.78,20.71 v25.1,21.03
  Bottom 0.152: v25.1,21.03 25.07,21.01 U5.5
  Bottom 0.178: U1.15 19.07,4.9 20.33,3.64 v20.33,3.41
SYNC  (via drill 0.25 pad 0.55)
  Route2 0.152: v24.47,22.23 24.47,10.17 19.66,5.36 v19.66,3.13
  Bottom 0.152: 24.38,22.14 24.42,22.18 | 24.42,22.18 v24.47,22.23 | U5.3 23.3,22.1 23.6,22.1 23.68,22.18 24.42,22.18
  Bottom 0.178: v19.66,3.13 19.66,3.77 18.57,4.86 U1.16
USART1_RX
  Bottom 0.203: P1.PAD_PD4 6.52,7.85 8.23,9.56 U1.32
USART1_TX  (via drill 0.3 pad 0.7)
  Top 0.305: v7.57,7.91 7.5,7.85 P1.PAD_PU4
  Bottom 0.203: U1.29 7.71,8.06 v7.57,7.91
USART2_RX
  Bottom 0.305: U1.14 19.57,4.96 20.42,4.11 26.38,4.11 28.04,5.76 28.04,6.18 P1.PAD_PD2
USART2_TX  (via drill 0.3 pad 0.7)
  Top 0.305: v27.38,6.07 29.16,7.85 P1.PAD_PU2
  Bottom 0.305: U1.13 20.54,5.43 21.4,4.57 26.04,4.57 27.38,5.91 v27.38,6.07
USART3_RX
  Bottom 0.305: U1.23 15.07,0.69 P1.PAD_PD3
USART3_TX  (via drill 0.3 pad 0.7)
  Top 0.305: v15.87,2.94 17.32,1.48 P1.PAD_PU3
  Bottom 0.305: v15.87,2.94 15.57,3.23 U1.22
USART4_RX
  Bottom 0.305: U1.12 20.85,6.06 21.73,5.18 24.34,5.18 26.89,7.73 26.89,16.96 29.87,19.94 29.87,21.99 P1.PAD_PD1
USART4_TX  (via drill 0.3 pad 0.7)
  Top 0.305: v28.58,19.73 28.58,21.02 P1.PAD_PU1
  Bottom 0.305: U1.11 21.16,6.56 22.08,5.63 24.15,5.63 26.43,7.92 26.43,17.44 28.58,19.59 v28.58,19.73
USART5_RX
  Bottom 0.305: U1.40 16.07,13.05 15.1,14.02 15.1,14.05 7,22.15 P1.PAD_PD5
USART5_TX  (via drill 0.3 pad 0.6)
  Top 0.305: v7.65,22.56 5.34,22.56 P1.PAD_PU5
  Bottom 0.305: U1.41 16.57,13.35 7.96,21.95 7.96,22.24 v7.65,22.56
USART6_RX  (via drill 0.3 pad 0.6)
  Route2 0.305: v19.63,27.51 21.06,26.08 21.06,14.49 21.61,13.94 21.61,12.94 21.13,12.46 v20.65,12.46
  Bottom 0.305: P1.PAD_PD6 17.83,29.31 v19.63,27.51 | U1.48 20.07,12.24 20.29,12.46 v20.65,12.46
USART6_TX  (via drill 0.3 pad 0.6)
  Top 0.305: v18.9,27.08 17.32,28.67 P1.PAD_PU6
  Route2 0.305: v18.9,27.08 20.59,25.4 20.59,13.73 20.11,13.25 v20.11,13.1
  Bottom 0.305: U1.47 19.57,12.56 v20.11,13.1
VDD  (via drill 0.25 pad 0.55, 0.35 pad 0.75)
  Top 0.305: R4.2 21.13,21.21 22.77,22.85 22.77,23.81 23.33,24.37 v23.35,24.37
  Bottom 0.254: 11.92,23.75 11.92,23.41 11.92,23.15 U6.14
  Bottom 0.305: 11.92,23.41 v11.29,23.41
  Bottom 0.406: U6.14 11.97,24.31 C15.1 | U5.1 22.36,24.31 C9.1 22.41,24.37 v23.35,24.37
  other vias: 21.29,29.29 22.72,29.29 26.69,27.06 27.48,25.48 31.45,18.65 32.24,17.22 32.24,12.94 31.29,11.19 27.48,4.2 26.53,2.78 22.72,0.71 21.13,0.71 13.19,1.03 11.61,1.03 7.79,2.93 7,4.52 2.08,13.09 2.87,11.35 2.24,17.38 3.19,18.81 7,25.48 8.11,27.06 11.76,29.29 13.51,29.29 25.73,14.84 25.42,14.05 16.05,22.62 15.42,23.41 21.92,18.18 21.92,16.59
  pour Top (no thermals): 21.77,15.16 21.77,14.68 22.56,14.68 22.72,14.52 23.83,14.52 24.62,13.73 26.21,13.73 26.21,15.16
  pour Top (rank 3, no thermals): 8.59,30.08 25.89,30.08 34.62,15 26.05,0.08 8.75,0.08 0.02,15
  pour Route15 (rank 2, no thermals): 8.59,30.08 25.89,30.08 34.62,15 26.05,0.08 8.75,0.08 0.02,15.16 0.02,15.16 0.02,15.16 5.53,24.35
  pour Top (no thermals): 17.96,22.3 17.96,22.94 16.05,22.94 16.05,24.21 14.94,24.21 14.94,22.3
  pour Bottom (no thermals): 21.45,18.65 21.45,16.11 22.56,16.11 22.56,18.65
VDDA
  pour Bottom (no thermals): 20.5,10.24 20.5,8.97 21.45,8.97 22.56,10.08 22.56,15.79 21.45,15.79 21.45,10.4 21.29,10.24
VSSA
  Bottom 0.305: U1.7 21.68,8.56 22.69,9.56 23.15,9.56 23.53,9.93 C6.2
  pour Bottom (no thermals): 25.1,15.79 25.1,15 24.3,14.21 24.3,12.3 23.99,11.98 23.99,10.08 23.19,10.08 23.19,14.21 23.99,15 23.99,15.63 24.15,15.79

### Text on the board
tPlace: 3V3 | 3V3 | P6 | P5 | P1 | B | 3V3 | 3V3 | C | D | P4* | P2* | 3V3 | P3 | 3V3
bPlace: GND | GND | P6 | P5 | P1 | GND | GND | * | P4* | P2* | GND | P3 | GND
bNames: H08R62 | U1